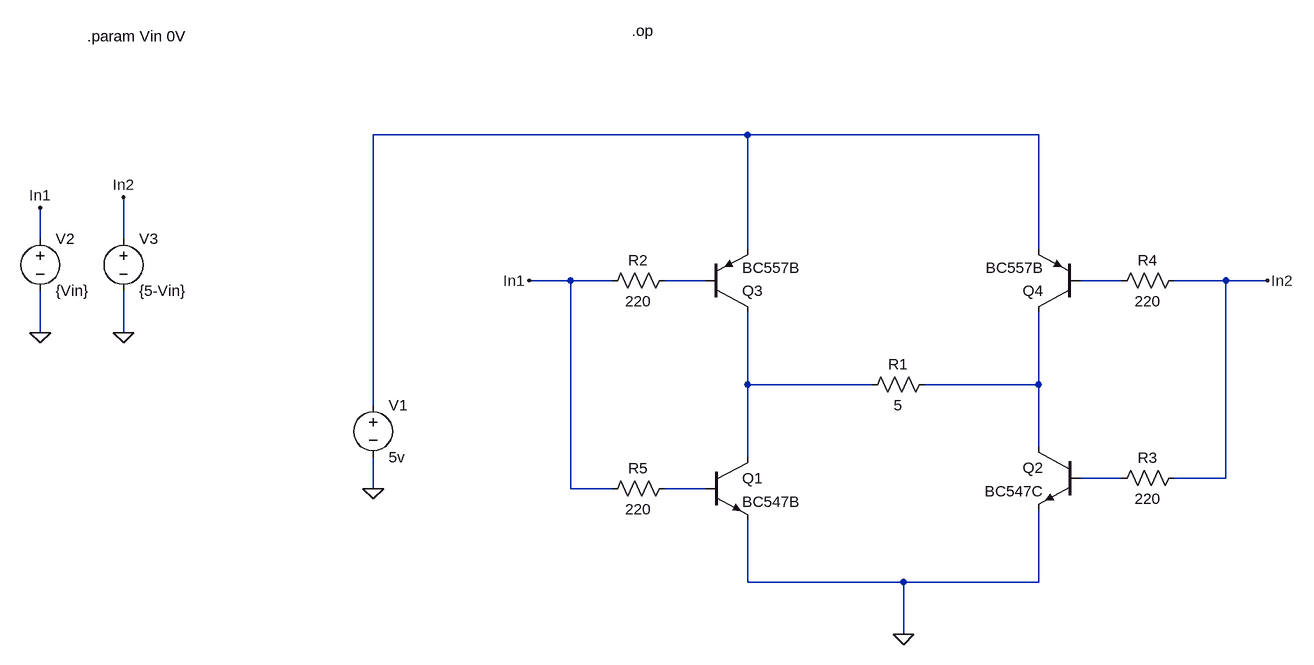
[diagram p0: schematic HBridge.asc]
HBridge.asc, the LTspice schematic file:
Version 4
SHEET 1 1208 680
WIRE 304 -416 -272 -416
WIRE 752 -416 304 -416
WIRE -784 -256 -784 -304
WIRE -656 -256 -656 -320
WIRE 304 -240 304 -416
WIRE 752 -240 752 -416
WIRE 32 -192 -32 -192
WIRE 96 -192 32 -192
WIRE 240 -192 176 -192
WIRE 880 -192 816 -192
WIRE 1040 -192 960 -192
WIRE 1104 -192 1040 -192
WIRE -784 -112 -784 -176
WIRE -656 -112 -656 -176
WIRE 304 -32 304 -144
WIRE 496 -32 304 -32
WIRE 752 -32 752 -144
WIRE 752 -32 576 -32
WIRE -272 0 -272 -416
WIRE 752 64 752 -32
WIRE 304 80 304 -32
WIRE 880 112 816 112
WIRE 1040 112 1040 -192
WIRE 1040 112 960 112
WIRE -272 128 -272 80
WIRE 32 128 32 -192
WIRE 96 128 32 128
WIRE 240 128 176 128
WIRE 304 272 304 176
WIRE 544 272 304 272
WIRE 752 272 752 160
WIRE 752 272 544 272
WIRE 544 352 544 272
FLAG 544 352 0
FLAG -272 128 0
FLAG -32 -192 In1
FLAG 1104 -192 In2
FLAG -784 -112 0
FLAG -656 -112 0
FLAG -784 -304 In1
FLAG -656 -320 In2
SYMBOL voltage -272 -16 R0
WINDOW 123 0 0 Left 0
WINDOW 39 0 0 Left 0
SYMATTR InstName V1
SYMATTR Value 5v
SYMBOL npn 240 80 R0
SYMATTR InstName Q1
SYMATTR Value BC547B
SYMBOL npn 816 64 M0
SYMATTR InstName Q2
SYMATTR Value BC547C
SYMBOL pnp 240 -144 M180
SYMATTR InstName Q3
SYMATTR Value BC557B
SYMBOL pnp 816 -144 R180
SYMATTR InstName Q4
SYMATTR Value BC557B
SYMBOL res 592 -48 R90
WINDOW 0 0 56 VBottom 2
WINDOW 3 32 56 VTop 2
SYMATTR InstName R1
SYMATTR Value 5
SYMBOL res 192 -208 R90
WINDOW 0 0 56 VBottom 2
WINDOW 3 32 56 VTop 2
SYMATTR InstName R2
SYMATTR Value 220
SYMBOL res 976 -208 R90
WINDOW 0 0 56 VBottom 2
WINDOW 3 32 56 VTop 2
SYMATTR InstName R4
SYMATTR Value 220
SYMBOL voltage -784 -272 R0
WINDOW 123 0 0 Left 0
WINDOW 39 0 0 Left 0
SYMATTR InstName V2
SYMATTR Value {Vin}
SYMBOL voltage -656 -272 R0
WINDOW 123 0 0 Left 0
WINDOW 39 0 0 Left 0
SYMATTR InstName V3
SYMATTR Value {5-Vin}
SYMBOL res 976 96 R90
WINDOW 0 0 56 VBottom 2
WINDOW 3 32 56 VTop 2
SYMATTR InstName R3
SYMATTR Value 220
SYMBOL res 192 112 R90
WINDOW 0 0 56 VBottom 2
WINDOW 3 32 56 VTop 2
SYMATTR InstName R5
SYMATTR Value 220
TEXT 126 -576 Left 2 !.op
TEXT -712 -568 Left 2 !.param Vin 0V

The netlist it stands for:
* HBridge.asc
V1 N001 0 5v
Q1 N004 N007 0 0 BC547B
Q2 N005 N006 0 0 BC547C
Q3 N004 N002 N001 0 BC557B
Q4 N005 N003 N001 0 BC557B
R1 N005 N004 5
R2 N002 In1 220
R4 In2 N003 220
V2 In1 0 {Vin}
V3 In2 0 {5-Vin}
R3 In2 N006 220
R5 N007 In1 220
.model NPN NPN
.model PNP PNP
.lib standard.bjt
.op
.param Vin 0V
.backanno
.end